# Altium schematic sheet BPC_PWR.schdoc: Eurocard VME 6U (9.187 x 6.299 inches) (part 3 of 3)
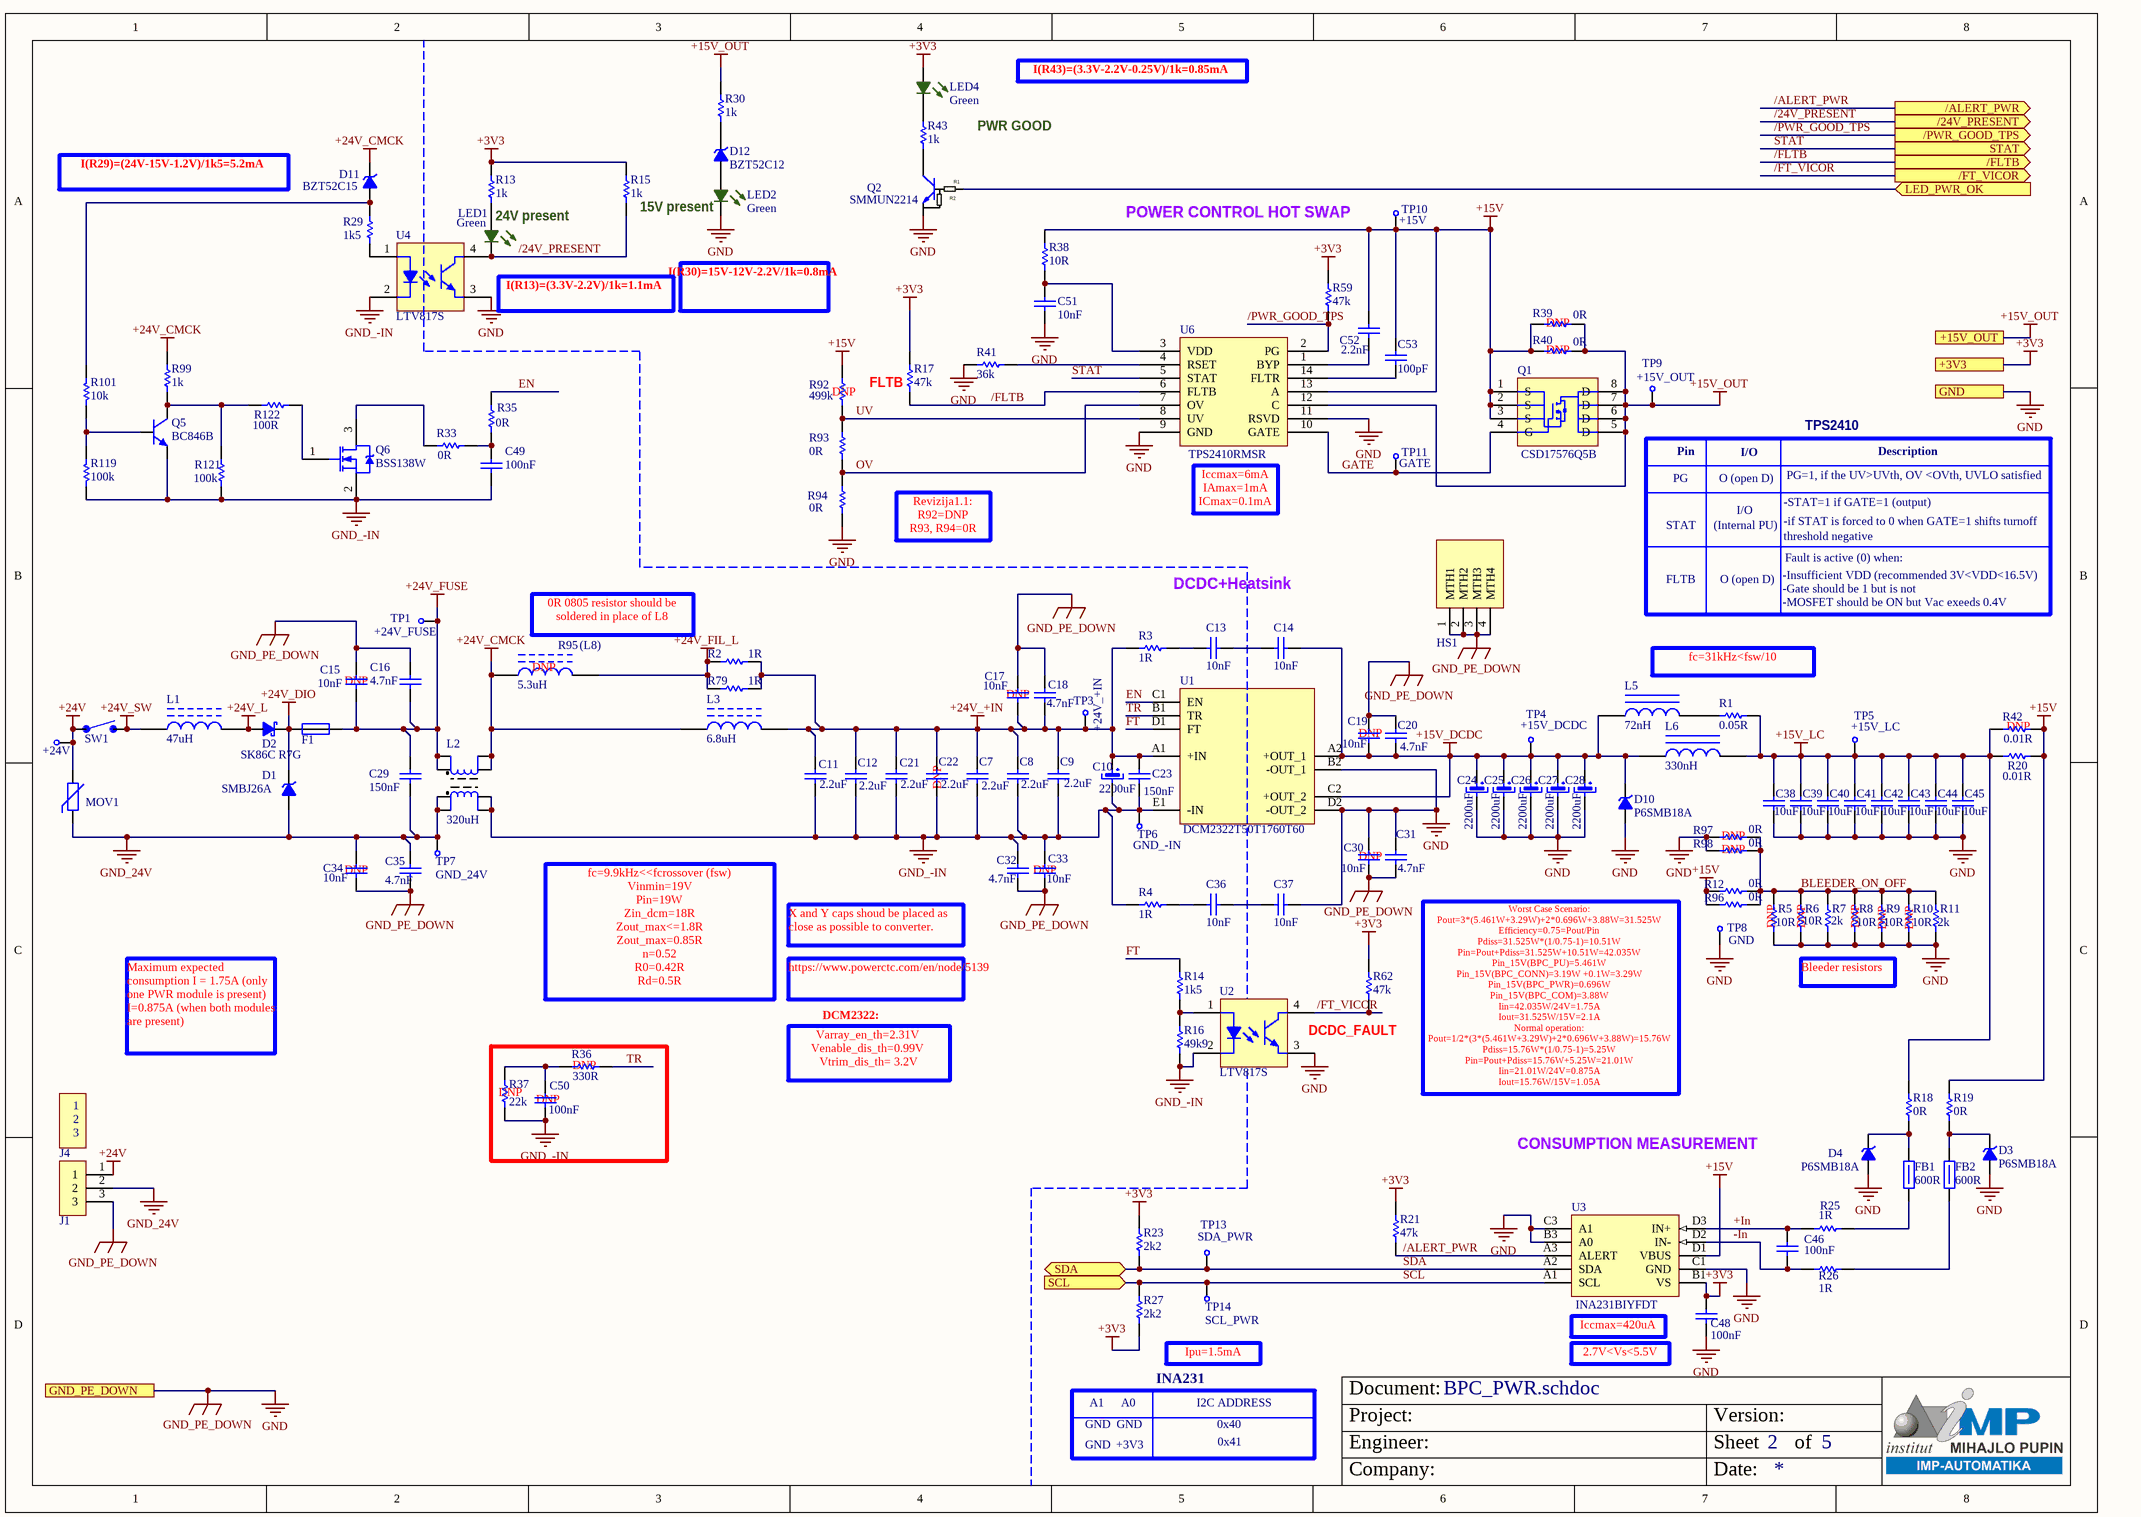
[diagram p2: BPC_PWR.schdoc]

## Library data of the parts (continued)
R122 = Res 100R 1% 100mW 0603 MS Pt02: Resistor 100R 1% 100mW 0603; Manufacturer: Stackpole Electronics Inc; Manufacturer Part Number: RMCF0603FT100R; Temperature Coefficient: 100ppm/°C; Production Status: Active; Distributor: Digi-Key; Distributor Part Number: RMCF0603FT100RCT-ND; Last Revision Date: 26.07.2021; Temperature Range: -55°C ~ +155°C; Mounting: SMD; ComponentLink1Description: Datasheet; ComponentLink1URL: https://www.seielect.com/catalog/sei-rmcf_rmcp.pdf; ComponentLink2Description: Distributor; ComponentLink2URL: https://www.digikey.com/en/products/detail/stackpole-electronics-inc/RMCF0603FT100R/1761113; ComponentLink3Description: Manufacturer; ComponentLink3URL: https://www.seielect.com/catalog/sei-rmcf_rmcp.pdf; Status: Not Checked; Power Rating: 100mW; Tolerance: ±1%; DB Parameter 1: 100R; DB Parameter 2: ±1%; DB Parameter 3: 100mW
SW1 = El-Mech Switch DF52J12P215HQA MS: Rocker Switch 16A 125V; Manufacturer: C&K; Rated Current: 10AAC, 6ADC; Rated Voltage: 250VAC, 48VDC; Production Status: Active; Distributor: Digi-Key; Distributor Part Number: CKN11830-ND; Manufacturer Part Number: DF52J12P215HQA; Last Revision Date: 01.10.2021; Mounting: Panel mount; ComponentLink1Description: Datasheet; ComponentLink1URL: https://www.ckswitches.com/media/1443/df.pdf; ComponentLink2Description: Distributor; ComponentLink2URL: https://www.digikey.com/en/products/detail/c-k/DF52J12P215HQA/3752604; ComponentLink3Description: Manufacturer; ComponentLink3URL: https://www.ckswitches.com/products/switches/product-details/Rocker/DF/DF52J12P215HQA/; Status: Not Checked; DB Parameter 1: 250VAC, 48VDC; DB Parameter 2: 10AAC, 6ADC
U1 = DC/DC 24V:15V 50W DCM2322T50T1760T60 MS: Isolated Module DC DC Converter 1 Output 15V  4A  9V - 50V Input; Manufacturer: Vicor Corporation; Input Voltage: 9V ~ 50V; Production Status: Active; Isolation: 3V; Distributor: Digi-Key; Distributor Part Number: 1102-DCM2322T50T1760T60-ND; Last Revision Date: 09.03.2021; Temperature Range: -40°C ~ +125°C; Mounting: TH; ComponentLink1Description: Datasheet; ComponentLink1URL: http://www.vicorpower.com/documents/datasheets/DCM2322x50T1760y6z_ds.pdf; ComponentLink2Description: Distributor; ComponentLink2URL: https://www.digikey.com/en/products/detail/vicor-corporation/DCM2322T50T1760T60/10413813; ComponentLink3Description: Manufacturer; ComponentLink3URL: http://www.vicorpower.com/products?productType=cfg&productKey=DCM2322T50T1760T60; Status: Not Checked; Output Voltage: 15V; DB Parameter 1: DCM2322T50T1760T60; DB Parameter 2: 4A; DB Parameter 3: 15V; Output Current: 4A; Manufacturer Part Number: DCM2322T50T1760T60
U2 U4 = IC LTV817S: Optocoupler 5KV Transistor 4-SMD; Manufacturer: Lite-On Inc.; Manufacturer Part Number: LTV-817S; Isolation Voltage: 5000 Vrms; Forward Voltage: 1.2V; Max Forward Current: 50mA; Max Output Voltage: 35V; DB Parameter 3: 4us; Production status: Active; Distributor: Digi-Key; Distributor Part Number: 160-1367-5-ND; Last Revision Date: 17.03.2021; Temperature Range: -30°C ~ +110°C; Mounting: SMD; ComponentLink1Description: Datasheet; ComponentLink1URL: https://optoelectronics.liteon.com/upload/download/DS-70-96-0016/LTV-8X7%20series%20201610%20.pdf; ComponentLink2Description: Distributor; ComponentLink2URL: https://www.digikey.com/en/products/detail/lite-on-inc/LTV-817S/385837; ComponentLink3Description: Manufacturer; ComponentLink3URL: https://optoelectronics.liteon.com/upload/download/DS-70-96-0016/LTV-8X7%20series%20201610%20.pdf; Status: Not Checked; DB Parameter 1: 1.2V; DB Parameter 2: 5000 Vrms; Rise/Fall time: 4us
U3 = IC INA231BIYFDT MS: IC MONITOR PWR/CURR BIDIR 10MSOP; Manufacturer: Texas Instruments; Power Supply: 2.7V ~ 5.5V; DB Parameter 1: 0V ~ 36V; Production Status: Active; Sense Voltage: 0V ~ 25V; Distributor: Mouser; Distributor Part Number: 595-INA231BIYFDT; Last Revision Date: 26.07.2021; Temperature Range: -40°C ~ +125°C; Mounting: SMD; ComponentLink1Description: Datasheet; ComponentLink1URL: https://www.ti.com/lit/ds/symlink/ina231.pdf?HQS=dis-mous-null-mousermode-dsf-pf-null-wwe&DCM=yes&ref_url=https%3A%2F%2Feu.mouser.com%2F&distId=26; ComponentLink2Description: Distributor; ComponentLink2URL: https://eu.mouser.com/ProductDetail/Texas-Instruments/INA231BIYFDT?qs=%2Fha2pyFadui7MHIC05DHFvKEuHw3A34T1OGTYifc7galKUOlGM%2FqWQ%3D%3D; ComponentLink3Description: Manufacturer; ComponentLink3URL: https://www.ti.com/product/INA231?keyMatch=INA231BIYFDT&tisearch=search-everything; Status: Not Checked; Manufacturer Part Number: INA231BIYFDT
U6 = IC TPS2410RMSR MS: IC OR CTRLR N+1 UQFN; Manufacturer: Texas Instruments; Power Supply: 3V~16.5V; Production Status: Active; Distributor: Mouser; Distributor Part Number: 595-TPS2410RMSR; Last Revision Date: 26.07.2021; Temperature Range: -40°C ~ +85°C; Mounting: SMD; ComponentLink1Description: Datasheet; ComponentLink1URL: https://www.ti.com/lit/ds/symlink/tps2410.pdf?ts=1627292155251&ref_url=https%253A%252F%252Fwww.ti.com%252Fproduct%252FTPS2410; ComponentLink2Description: Distributor; ComponentLink2URL: https://eu.mouser.com/ProductDetail/Texas-Instruments/TPS2410RMSR?qs=d0WKAl%252BL4KZPBEcdojYg8Q%3D%3D; ComponentLink3Description: Manufacturer; ComponentLink3URL: https://www.ti.com/product/TPS2410?keyMatch=TPS2410&tisearch=search-everything; Status: Not Checked; DB Parameter 1: TPS2410RMSR; DB Parameter 2: 3V~16.5V; Manufacturer Part Number: TPS2410RMSR